# Altium schematic sheet SCH_MR60FDA1 60GHz Radar to FTDI Adapter_2023-03-13.schdoc
size 219 x 105 mm
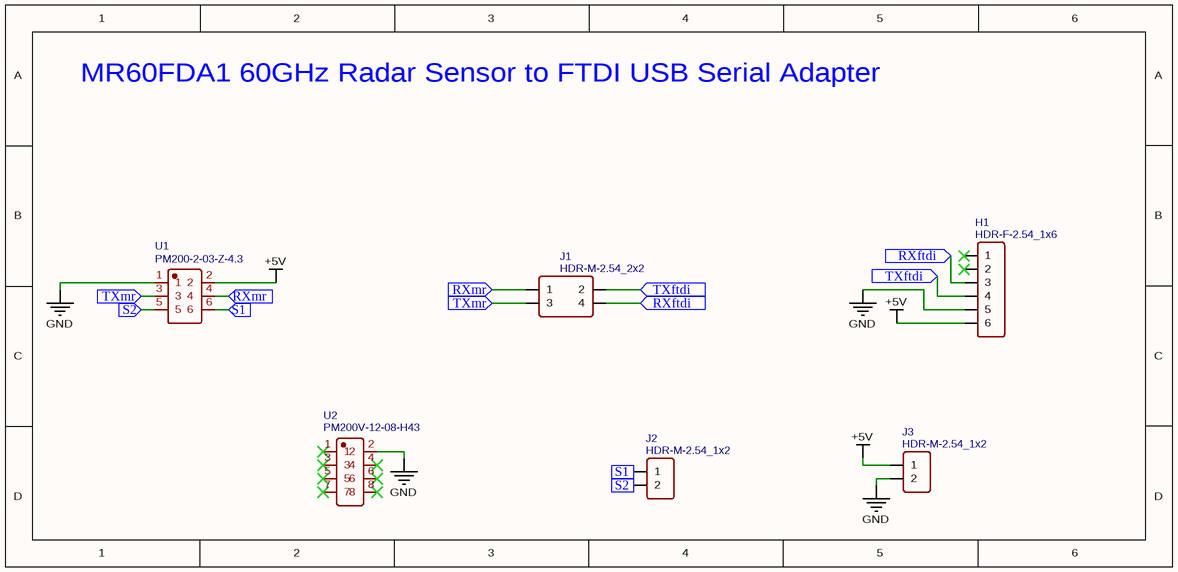
[diagram p0: SCH_MR60FDA1 60GHz Radar to FTDI Adapter_2023-03-13.schdoc]

## Parts
H1  HDR-F-2.54_1x6  [HDR-F-2.54_1X6]
J1  HDR-M-2.54_2x2  [HDR-M-2.54_2X2]
J2  HDR-M-2.54_1x2  [HDR-M-2.54_1X2]
J3  HDR-M-2.54_1x2  [HDR-M-2.54_1X2]
U1  PM200-2-03-Z-4.3  [HDR-TH_6P-P2.00-V-F-R2-C3-S2.00]
U2  PM200V-12-08-H43  [HDR-TH_8P-P2.00-V-F-R2-C4-S2.00-1]

## Ports
RXftdi (in), RXmr (in), S1 (in), S2 (in), TXftdi (in), TXmr (in)

## Nets
+5V: H1.6 J3.1 U1.2
GND: H1.5 J3.2 U1.1 U2.2
RXftdi: H1.3 J1.4 ; port RXftdi
RXmr: J1.1 U1.4 ; port RXmr
S1: J2.1 U1.6 ; port S1
S2: J2.2 U1.5 ; port S2
TXftdi: H1.4 J1.2 ; port TXftdi
TXmr: J1.3 U1.3 ; port TXmr

Not connected (* = marked no-connect by the designer): H1 1* 2*; U2 1* 3* 4* 5* 6* 7* 8*

## Notes on the sheet
- MR60FDA1 60GHz Radar Sensor to FTDI USB Serial Adapter

## Library data of the parts
H1 = HDR-F-2.54_1x6: Contributor: LCEDA_Lib; BOM_Supplier Part: C40877; BOM_Supplier: LCSC; spicePre: H; spiceSymbolName: HDR-F-2.54_1x6
J1 = HDR-M-2.54_2x2: Contributor: LCEDA_Lib; BOM_Supplier Part: C66690; BOM_Supplier: LCSC; spicePre: J; spiceSymbolName: HDR-M-2.54_2x2
J2 J3 = HDR-M-2.54_1x2: Contributor: LCEDA_Lib; BOM_Supplier Part: C124375; BOM_Supplier: LCSC; spicePre: J; spiceSymbolName: HDR-M-2.54_1x2
U1 = PM200-2-03-Z-4.3: BOM_Manufacturer: HCTL(华灿天禄); Contributor: LCSC; BOM_Supplier: LCSC; BOM_Supplier Part: C2906071; BOM_Manufacturer Part: PM200-2-03-Z-4.3; BOM_JLCPCB Part Class: Extended Part; spicePre: U; spiceSymbolName: PM200-2-03-Z-4.3
U2 = PM200V-12-08-H43: BOM_Manufacturer: XFCN(兴飞); Contributor: LCSC; BOM_Supplier: LCSC; BOM_Supplier Part: C2925563; BOM_Manufacturer Part: PM200V-12-08-H43; BOM_JLCPCB Part Class: Extended Part; spicePre: U; spiceSymbolName: PM200V-12-08-H43